# EAGLE design SparkFun_9DoF_ISM330DHCX-MMC5983MA (EAGLE 9.6.2)
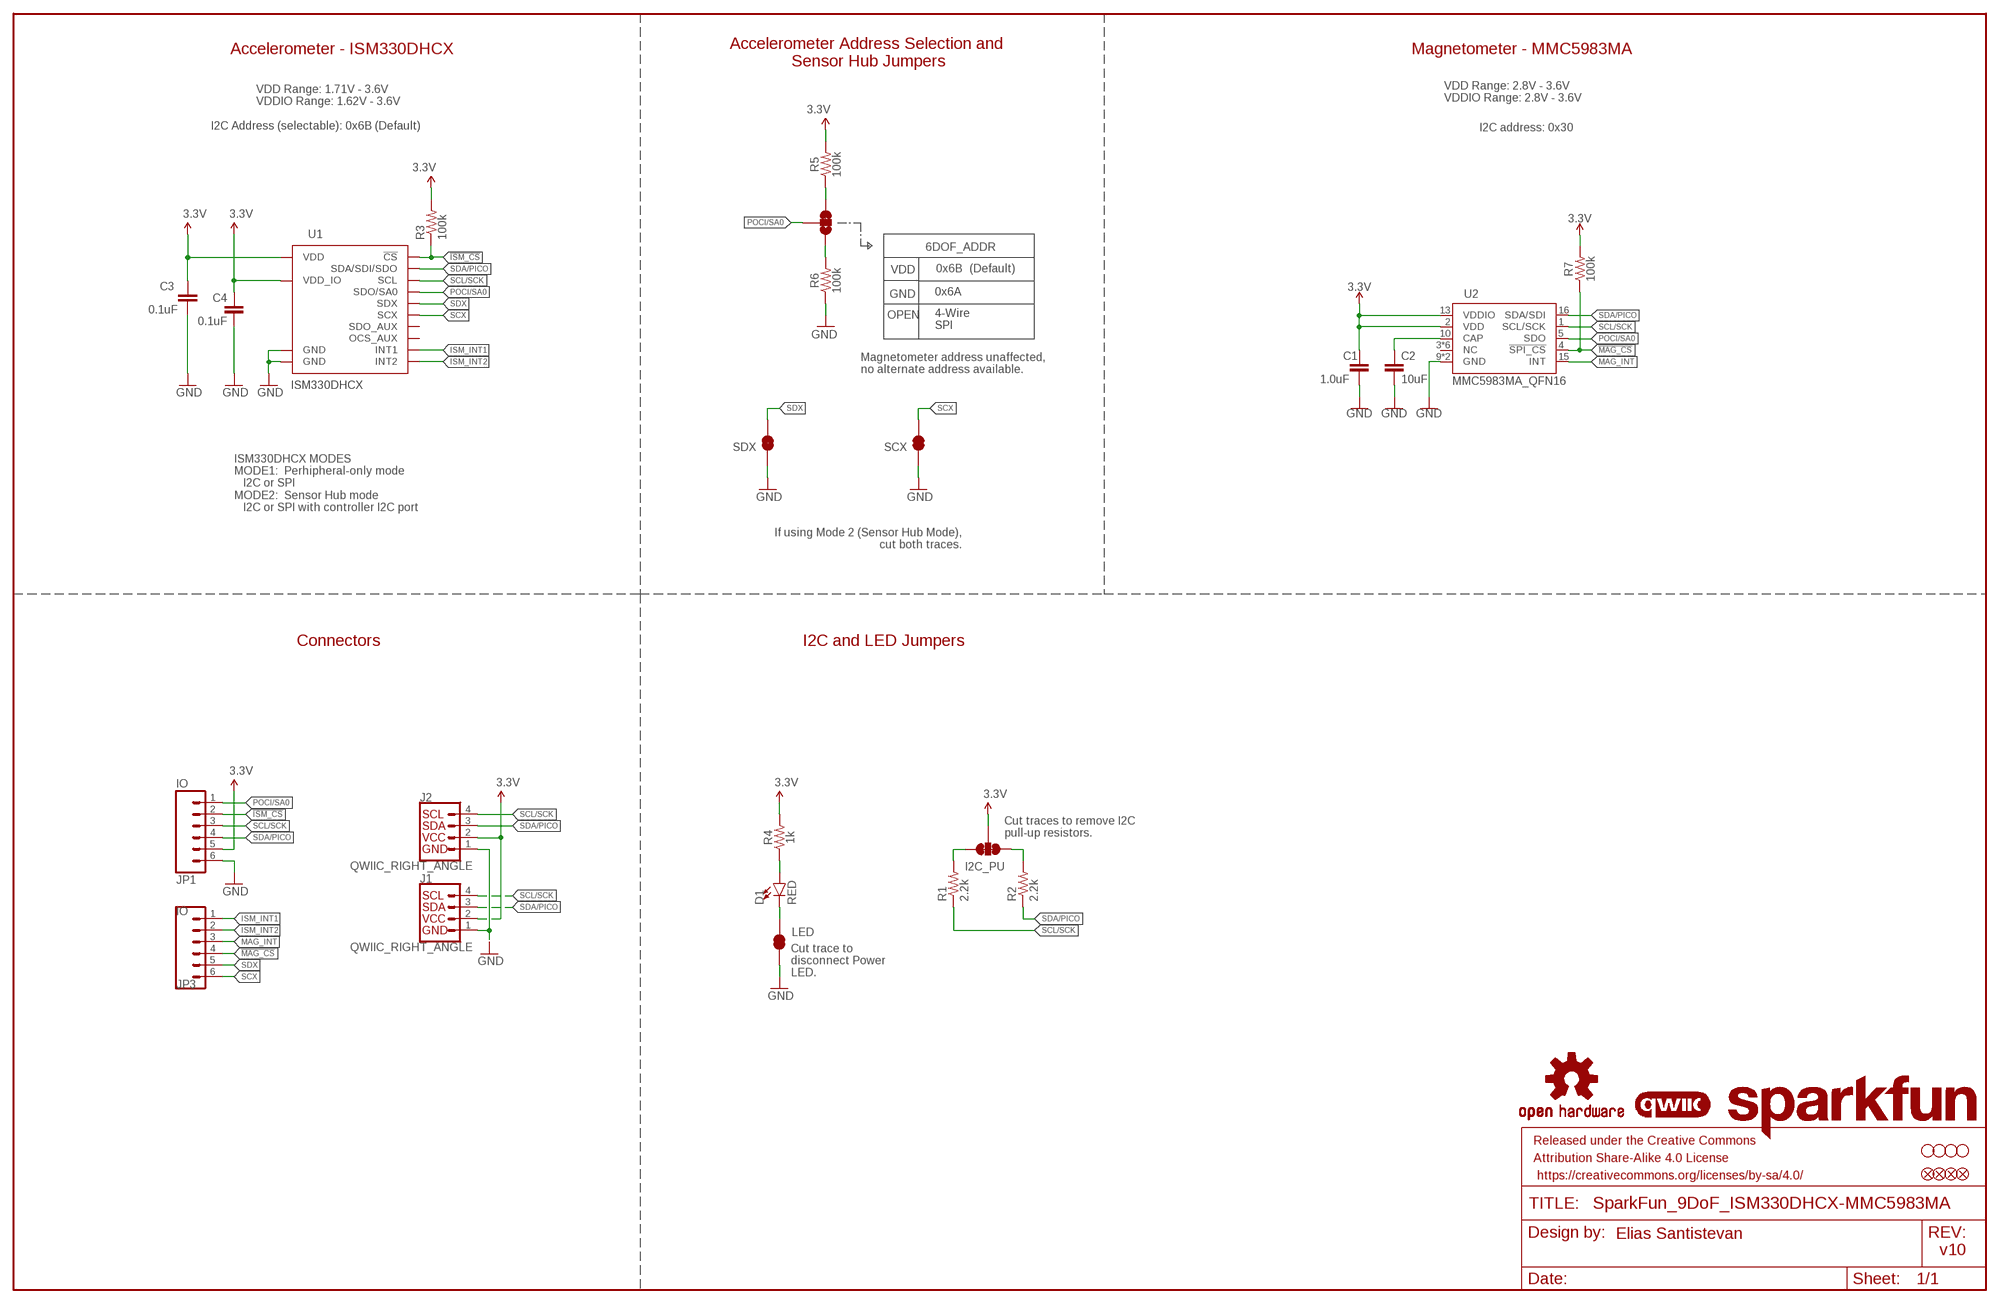
[diagram p0: schematic, sheet 1]

## Parts
6DOF_ADDR  JUMPER-SMT_3_1-NC_TRACE_SILK  [SMT-JUMPER_3_1-NC_TRACE_SILK]
C1  1.0uF  1.0UF-0603-16V-10%  [0603]
C2  10uF  10UF-0603-6.3V-20%  [0603]
C3  0.1uF  0.1UF-0603-25V-(+80/-20%)  [0603]
C4  0.1uF  0.1UF-0603-25V-(+80/-20%)  [0603]
D1  RED  LED-RED0603  [LED-0603]
FD1  FIDUCIALUFIDUCIAL  [FIDUCIAL-MICRO]
FD2  FIDUCIALUFIDUCIAL  [FIDUCIAL-MICRO]
FID1  FIDUCIALUFIDUCIAL  [FIDUCIAL-MICRO]
FID2  FIDUCIALUFIDUCIAL  [FIDUCIAL-MICRO]
FRAME2  FRAME-LEDGER  [CREATIVE_COMMONS]
I2C_PU  S_MODE  JUMPER-SMT_3_2-NC_TRACE_SILK  [SMT-JUMPER_3_2-NC_TRACE_SILK]
J1  QWIIC_RIGHT_ANGLE  QWIIC_CONNECTORJS-1MM  [JST04_1MM_RA]
J2  QWIIC_RIGHT_ANGLE  QWIIC_CONNECTORJS-1MM  [JST04_1MM_RA]
JP1  IO  CONN_06NO_SILK_NO_POP  [1X06_NO_SILK]
JP3  IO  CONN_06NO_SILK_NO_POP  [1X06_NO_SILK]
LED  JUMPER-SMT_2_NC_TRACE_SILK  [SMT-JUMPER_2_NC_TRACE_SILK]
LOGO1  QWIIC_LOGO_4MM  [QWIIC_4MM]
LOGO2  OSHW-LOGOMINI  [OSHW-LOGO-MINI]
LOGO3  SFE_LOGO_NAME.1_INCH  [SFE_LOGO_NAME_.1]
R1  2.2k  2.2KOHM-0603-1/10W-1%  [0603]
R2  2.2k  2.2KOHM-0603-1/10W-1%  [0603]
R3  100k  100KOHM-0603-1/10W-1%  [0603]
R4  1k  1KOHM-0603-1/10W-1%  [0603]
R5  100k  100KOHM-0603-1/10W-1%  [0603]
R6  100k  100KOHM-0603-1/10W-1%  [0603]
R7  100k  100KOHM-0603-1/10W-1%  [0603]
SCX  JUMPER-SMT_2_NC_TRACE_SILK  [SMT-JUMPER_2_NC_TRACE_SILK]
SDX  JUMPER-SMT_2_NC_TRACE_SILK  [SMT-JUMPER_2_NC_TRACE_SILK]
STANDOFF1  STAND-OFFTIGHT  [STAND-OFF-TIGHT]
STANDOFF2  STAND-OFFTIGHT  [STAND-OFF-TIGHT]
STANDOFF3  STAND-OFFTIGHT  [STAND-OFF-TIGHT]
STANDOFF4  STAND-OFFTIGHT  [STAND-OFF-TIGHT]
U1  ISM330DHCX  [LGA-14L]
U2  MMC5983MA_QFN16  [LGA-16-3X3MM-4X4PINS]

## Nets
3.3V: C1.1 C3.1 C4.1 I2C_PU.2 J1.2 J2.2 JP1.5 R3.2 R4.2 R5.2 R7.2 U1.P5(VDD_IO) U1.P8(VDD) U2.2(VDD) U2.13(VDDIO)
!ISM_CS!: JP1.2 R3.1 U1.P12(!CS!)
!MAG_CS!: JP3.4 R7.1 U2.4(!SPI_CS!)
CAP: C2.1 U2.10(CAP)
GND: C1.2 C2.2 C3.2 C4.2 J1.1 J2.1 JP1.6 LED.1 R6.1 SCX.1 SDX.1 U1.P6(GND) U1.P7(GND) U2.9(GND) U2.11(GND)
ISM_INT1: JP3.1 U1.P4(INT1)
ISM_INT2: JP3.2 U1.P9(INT2)
MAG_INT: JP3.3 U2.15(INT)
N$1: 6DOF_ADDR.3 R5.1
N$2: D1.A R4.1
N$3: D1.C LED.2
N$5: I2C_PU.1 R1.2
N$6: I2C_PU.3 R2.2
N$7: 6DOF_ADDR.1 R6.2
POCI/SA0: 6DOF_ADDR.2 JP1.1 U1.P1(SDO/SA0) U2.5(SDO)
SCL/SCK: J1.4 J2.4 JP1.3 R1.1 U1.P13(SCL) U2.1(SCL/SCK)
SCX: JP3.6 SCX.2 U1.P3(SCX)
SDA/PICO: J1.3 J2.3 JP1.4 R2.1 U1.P14(SDA/SDI/SDO) U2.16(SDA/SDI)
SDX: JP3.5 SDX.2 U1.P2(SDX)
Unconnected: U1.P10(OCS_AUX) U1.P11(SDO_AUX) U2.3(NC) U2.6(NC) U2.7(NC) U2.8(NC) U2.12(NC) U2.14(NC)

## Notes on the sheet
- Accelerometer - ISM330DHCX | Magnetometer - MMC5983MA
- Accelerometer Address Selection and 
  Sensor Hub Jumpers
- VDD Range: 2.8V - 3.6V
  VDDIO Range: 2.8V - 3.6V
- VDD Range: 1.71V - 3.6V
  VDDIO Range: 1.62V - 3.6V
- I2C Address (selectable): 0x6B (Default) | I2C address: 0x30
- VDD | 0x6B | (Default)
- GND | 0x6A
- OPEN
- 4-Wire
  SPI
- Magnetometer address unaffected,
  no alternate address available.
- ISM330DHCX MODES
  MODE1:  Perhipheral-only mode
     I2C or SPI
  MODE2:  Sensor Hub mode
     I2C or SPI with controller I2C port
- If using Mode 2 (Sensor Hub Mode), 
  cut both traces.
- Connectors | I2C and LED Jumpers
- Cut traces to remove I2C
  pull-up resistors.
- Cut trace to
  disconnect Power
  LED.
- Elias Santistevan
- v10

## Library data of the parts
6DOF_ADDR = SparkFun-Jumpers:JUMPER-SMT_3_1-NC_TRACE: Normally closed trace jumper (1 of 2 connections) This jumper has a trace between two pads so it's normally closed (NC). The other connection is normally open (NO). Use a razor knife to open the connection. For best results follow the IPC guidelines for cutting traces: Cutout at least 0.063 mm (0.005 in). Remove all loose material to clean up the cut area. Seal the cut with an approved epoxy. Reapply solder to reclose the connection, or to close the NO connection.
C1 = SparkFun-Capacitors:1.0UF: 1µF ceramic capacitors A capacitor is a passive two-terminal electrical component used to store electrical energy temporarily in an electric field.; PROD_ID: CAP-00868
C2 = SparkFun-Capacitors:10UF: 10.0µF ceramic capacitors A capacitor is a passive two-terminal electrical component used to store electrical energy temporarily in an electric field.; PROD_ID: CAP-11015
C3 C4 = SparkFun-Capacitors:0.1UF: 0.1µF ceramic capacitors A capacitor is a passive two-terminal electrical component used to store electrical energy temporarily in an electric field.; PROD_ID: CAP-00810
D1 = SparkFun-LED:LED-RED: Red SMD LED Used in manufacturing of most products at SparkFun Packages: 0603 - SMD 0603 package [Product Link] <http://docs.avagotech.com/docs/AV02-0551EN> 0603 SMART - SMD 0603 SMART package ( more efficient and expensive)[Product Link] <http://www.osram-os.com/Graphics/XPic2/00077099_0.pdf> 1206 - SMD1206 package [Product Link] <https://www.sparkfun.com/datasheets/DevTools/LilyPad/Q150OVS4.pdff> SparkFun Products: Pro Mini 328 -5V <https://www.sparkfun.com/products/821> RedBoard <https://www.sparkfun.com/products/12757> IOIO-OTG <https://www.sparkfun.com/products/13613>; PROD_ID: DIO-00819
FD1 FD2 FID1 FID2 = SparkFun-Aesthetics:FIDUCIAL: Fiducial Alignment Points Point-of-reference for pick-and-place machines and other optical instruments.
FRAME2 = SparkFun-Aesthetics:FRAME-LEDGER: Schematic Frame - Ledger Standard 11x14 US Ledger frame
I2C_PU = SparkFun-Jumpers:JUMPER-SMT_3_2-NC_TRACE: Normally closed trace jumper (2 of 2 connections) This jumper has a trace between all three pads so they are normally closed (NC). Use a razor knife to open the connection(s). For best results follow the IPC guidelines for cutting traces: Cutout at least 0.063 mm (0.005 in). Remove all loose material to clean up the cut area. Seal the cut with an approved epoxy. Reapply solder to reclose the connection(s).
J1 J2 = SparkFun-Connectors:QWIIC_CONNECTOR: SparkFun I2C Standard Qwiic Connector An SMD 1mm pitch JST connector makes it easy and quick (get it? Qwiic?) to connect I2C devices to each other. The Qwiic system <http://www.sparkfun.com/qwiic> enables fast and solderless connection between popular platforms and various sensors and actuators. We carry 200mm <https://www.sparkfun.com/products/14204>, 100mm <https://www.sparkfun.com/products/14205>, 50mm <https://www.sparkfun.com/products/14206>, and breadboard friendly <https://www.sparkfun.com/products/14207> Qwiic cables. We also offer 10 pcs strips <https://www.sparkfun.com/products/14323> the SMD connectors.; PROD_ID: CONN-13694
JP1 JP3 = SparkFun-Connectors:CONN_06: Multi connection point. Often used as Generic Header-pin footprint for 0.1 inch spaced/style header connections On any of the 0.1 inch spaced packages, you can populate with these: Break Away Headers - Straight <https://www.sparkfun.com/products/116> (PRT-00116) Break Away Male Headers - Right Angle <https://www.sparkfun.com/products/553> (PRT-00553) Female Headers <https://www.sparkfun.com/products/115> (PRT-00115) Break Away Headers - Machine Pin <https://www.sparkfun.com/products/117> (PRT-00117) Break Away Female Headers - Swiss Machine Pin <https://www.sparkfun.com/products/743> (PRT-00743) Arduino Stackable Header - 6 Pin <https://www.sparkfun.com/products/9280> (PRT-09280) For SCREWTERMINALS and SPRING TERMINALS visit here: Screw Terimnals on SparkFun.com <https://www.sparkfun.com/search/results?term=Screw+Terminals> (5mm/3.5mm/2.54mm spacing) This device is also useful as a general connection point to wire up your design to another part of your project. Our various solder wires solder well into these plated through hole pads. Hook-Up Wire - Assortment (Stranded, 22 AWG) <https://www.sparkfun.com/products/11375> (PRT-11375) Hook-Up Wire - Assortment (Solid Core, 22 AWG) <https://www.sparkfun.com/products/11367> (PRT-11367) View the entire wire category on our website here <https://www.sparkfun.com/categories/141>
LED SCX SDX = SparkFun-Jumpers:JUMPER-SMT_2_NC_TRACE: Normally closed trace jumper This jumper has a trace between two pads so it's normally closed (NC). Use a razor knife to open the connection. For best results follow the IPC guidelines for cutting traces: Cutout at least 0.063 mm (0.005 in). Remove all loose material to clean up the cut area. Seal the cut with an approved epoxy. Reapply solder to reclose the connection.
LOGO1 = SparkFun-Aesthetics:QWIIC_LOGO: Qwiic Logos for placement on schematic and PCB. The 5.5mm silk logo is best for placing next to Qwiic connector.
LOGO2 = SparkFun-Aesthetics:OSHW-LOGO: Open-Source Hardware (OSHW) Logo This logo indicates the piece of hardware it is found on incorporates a OSHW license and/or adheres to the definition of open source hardware found here: http://freedomdefined.org/OSHW
LOGO3 = SparkFun-Aesthetics:SFE_LOGO_NAME: SparkFun Font Logo This is the SparkFun name logo. The logo on the schematic will always be the same size; the package variant is the height of the flame part of the logo (or the height the flame would be, if it were drawn). Default layer for the logo on the board is tSilk.
R1 R2 = SparkFun-Resistors:2.2KOHM: 2.2kΩ resistor A resistor is a passive two-terminal electrical component that implements electrical resistance as a circuit element. Resistors act to reduce current flow, and, at the same time, act to lower voltage levels within circuits. - Wikipedia; PROD_ID: RES-08272
R3 R5-R7 = SparkFun-Resistors:100KOHM: 100kΩ resistor A resistor is a passive two-terminal electrical component that implements electrical resistance as a circuit element. Resistors act to reduce current flow, and, at the same time, act to lower voltage levels within circuits. - Wikipedia; PROD_ID: RES-07828
R4 = SparkFun-Resistors:1KOHM: 1kΩ resistor A resistor is a passive two-terminal electrical component that implements electrical resistance as a circuit element. Resistors act to reduce current flow, and, at the same time, act to lower voltage levels within circuits. - Wikipedia; PROD_ID: RES-07856
STANDOFF1-STANDOFF4 = SparkFun-Hardware:STAND-OFF: Stand Off Drill holes for mechanically mounting via screws, standoffs, etc. Note: Use the keepout ring to avoid running the screw head into surrounding components. Variant Overviews STAND-OFF - Mechanical footprint for a #4 phillips button head screw. STAND-OFF-TIGHT - Mechanical footprint for a #4 phillips button head screw, Example SparkFun Products Screw - Phillips Head (1/4", 4-40, 10 pack) <https://www.sparkfun.com/products/10453> (PRT-10453) Screw - Phillips Head (1/2", 4-40, 10 pack) <https://www.sparkfun.com/products/10452> (PRT-10452) Screw - Phillips Head (3/4", 4-40, 10 pack) <https://www.sparkfun.com/products/10451> (PRT-10451) Screw - Phillips Head (1", 4-40, 10 pack) <https://www.sparkfun.com/products/10450> (PRT-10450)
U1 = ISM330DHCX:ISM330DHCX: ISM330DHCX 6DoF The ISM330DHCX is a system-in-package featuring a high-performance 3D digital accelerometer and 3D digital gyroscope tailored for Industry 4.0 applications.; PROD_ID: IC-16693
U2 = SparkFun-Sensors:MMC5983MA: High Performance 3-axis Magnetic Sensor The MMC5983MA is an AEC-Q100 qualified complete 3-axis magnetic sensor with on-chip signal processing and integrated I2C/SPI bus suitable for use in automotive applications. The device can be connected directly to a microprocessor, eliminating the need for A/D converters or timing resources. It can measure magnetic fields within the full scale range of ±8 Gauss (G), with 0.25mG/0.0625mG per LSB resolution at 16bits/18bits operation mode and 0.4 mG total RMS noise level, enabling heading accuracy of ±0.5° in electronic compass applications.; PROD_ID: IC-16314

## Board
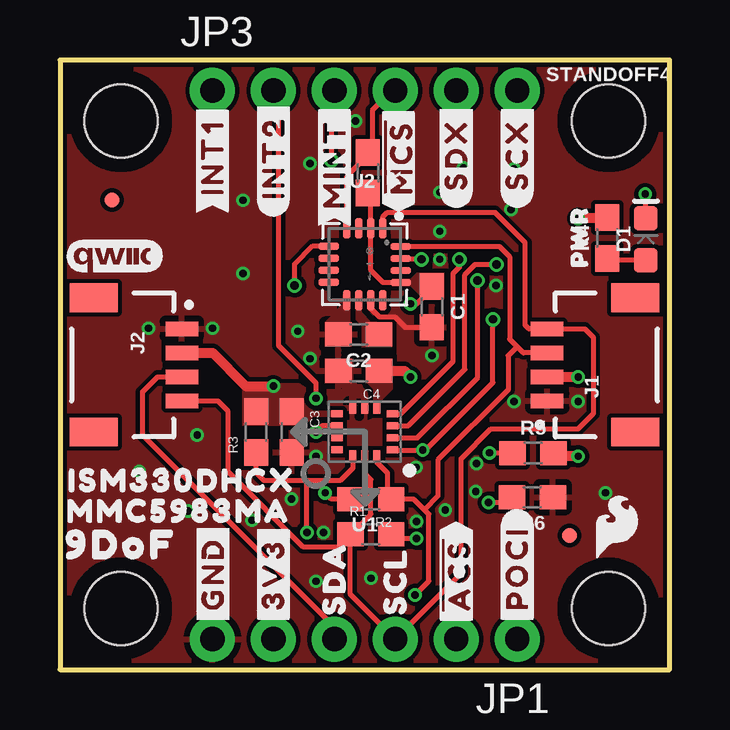
[diagram p1: board, top side]
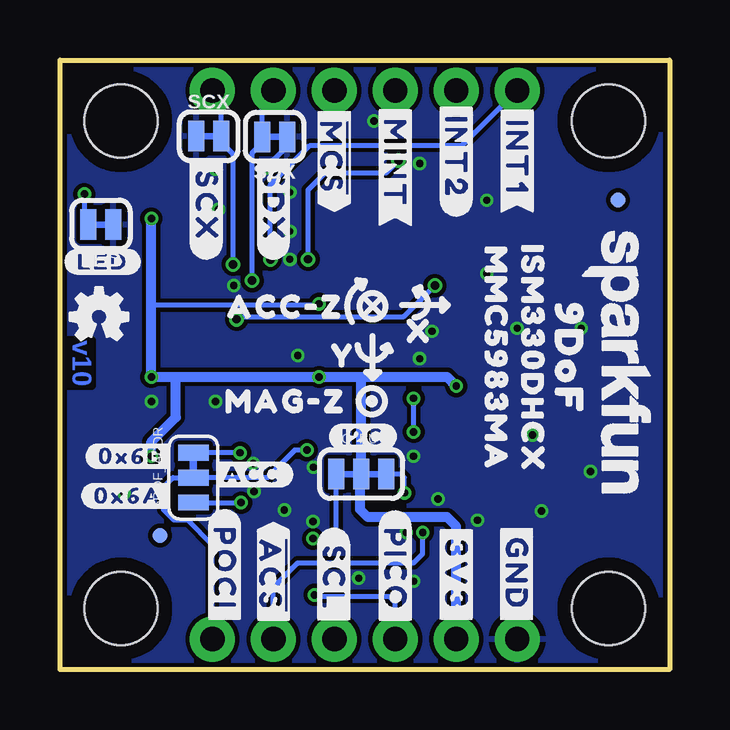
[diagram p2: board, bottom side, seen from below]

Size 25.4 x 25.4 mm. Coordinates in mm from the lower left corner, seen from the top.
Outline: 25.4,25.4 0,25.4 0,0 25.4,0 25.4,25.4
Copper layers (1*16): Top 0.035mm / dielectric 1.5mm / Bottom 0.035mm
Design rules "SparkFun-2-Layer-Minimum-JLCPCB": minimum track width 5mil, minimum drill 0.3mm, track to track 5mil, track to pad 5mil, pad to pad 5mil, via to via 5mil, smd to smd 5mil, copper to edge 7mil, drill to drill 7mil, minimum pad ring 5mil, minimum via ring 5mil, stop-mask expansion 2.5mil, vias tented up to drill 25mil, thermal gap 10mil
tRestrict: area 12.4,10.5 to 12.5,10.8; area 12.8,16 to 13.1,16.1; area 11.8,16 to 12.1,16.1; area 11.8,16 to 12.1,16.1; area 11.3,15.6 to 11.6,15.6

### Footprints (pad centres in the part's own frame; a part is rotated, then mirrored left to right if it is on the bottom)
SMT-JUMPER_3_1-NC_TRACE_SILK = smd 0.66 x 1.27: 1 -1.041,0; 2 0,0; 3 1.041,0
0603 = smd 1.1 x 1: 1 -0.85,0; 2 0.85,0
LED-0603 = smd 1 x 1: A -0.877,0; C 0.877,0
FIDUCIAL-MICRO = smd 0.635 x 0.635: 1 0,0
SMT-JUMPER_3_2-NC_TRACE_SILK = smd 0.66 x 1.27: 1 -1.041,0; 2 0,0; 3 1.041,0
JST04_1MM_RA = smd 0.6 x 1.35: 1 -1.5,0; 2 -0.5,0; 3 0.5,0; 4 1.5,0 | smd 1.2 x 2: NC1 2.8,-3.675; NC2 -2.8,-3.675
1X06_NO_SILK = drill 1.016 pad 1.88: 1 0,0; 2 2.54,0; 3 5.08,0; 4 7.62,0; 5 10.16,0; 6 12.7,0
SMT-JUMPER_2_NC_TRACE_SILK = smd 0.66 x 1.27: 1 -0.521,0; 2 0.521,0
STAND-OFF-TIGHT = hole 3.048: 0,0
LGA-14L = smd 0.48 x 0.3: P1 -1.163,0.75; P2 -1.163,0.25; P3 -1.163,-0.25; P4 -1.163,-0.75; P8 1.163,-0.75; P9 1.163,-0.25; P10 1.163,0.25; P11 1.163,0.75 | smd 0.3 x 0.48: P5 -0.5,-1; P6 0,-1; P7 0.5,-1; P12 0.5,1; P13 0,1; P14 -0.5,1
LGA-16-3X3MM-4X4PINS = smd 0.3 x 0.85: 1 0.754,1.498; 2 0.254,1.498; 3 -0.246,1.498; 4 -0.746,1.498; 9 -0.746,-1.506; 10 -0.246,-1.506; 11 0.254,-1.506; 12 0.754,-1.506 | smd 0.85 x 0.3: 5 -1.508,0.746; 6 -1.508,0.246; 7 -1.508,-0.254; 8 -1.508,-0.754; 13 1.496,-0.764; 14 1.496,-0.264; 15 1.496,0.236; 16 1.496,0.736

### Placement (x,y rotation side)
6DOF_ADDR  19.84,8 90 bottom
C1  15.49,15.11 270 top
C2  12.45,13.97 180 top
C3  9.65,9.9 270 top
C4  12.45,12.45 180 top
D1  24.41,17.93 90 top
FD1  2.16,19.56 0 bottom
FD2  21.23,5.59 0 bottom
FID1  2.16,19.56 0 top
FID2  21.23,5.59 0 top
FRAME2  -19.05,-20.32 0 top  (outside the outline)
I2C_PU  12.85,8.15 0 bottom
J1  20.29,12.7 90 top
J2  5.08,12.7 270 top
JP1  19.05,1.27 180 top
JP3  6.35,24.13 0 top
LED  23.7,18.54 180 bottom
LOGO1  2.29,17.22 0 top
LOGO2  23.77,14.71 0 bottom
LOGO3  2.21,12.79 270 bottom
R1  12.95,5.63 0 top
R2  12.95,7.11 180 top
R3  8.18,9.9 90 top
R4  22.81,17.98 90 top
R5  19.71,9.02 0 top
R6  19.68,7.19 180 top
R7  12.83,20.7 270 top
SCX  19.2,22.23 0 bottom
SDX  16.46,22.2 180 bottom
STANDOFF1  2.54,22.86 0 top
STANDOFF2  2.54,2.54 0 top
STANDOFF3  22.86,2.54 0 top
STANDOFF4  22.86,22.86 0 top
U1  12.7,9.91 180 top
U2  12.7,16.89 0 top
U$1  [#3V3#1]  8.89,3.96 90 top
U$2  [#GND#0]  6.38,3.99 90 top
U$3  [ISM330DHCX331]  5.08,7.87 0 top
U$4  [SDA14]  11.43,3.81 90 top
U$5  [SCL13]  13.97,3.68 90 top
U$6  [#POCI#11]  18.54,4.22 270 bottom
U$7  [ISM330DHCX331]  5.71,12.95 270 bottom
U$8  [#INT1#0]  6.35,21.34 90 top
U$9  [#INT2#3]  8.89,21.34 90 top
U$10  [#INT1#2]  6.35,21.34 270 bottom
U$11  [#INT2#2]  8.89,21.34 270 bottom
U$12  [#MINT#4]  11.43,21.08 270 bottom
U$13  [ACC#Z5985]  16,15.11 0 bottom
U$14  [MAG#Z5984]  16,11.18 0 bottom
U$15  [#3V3#1]  8.89,3.96 270 bottom
U$16  [#LED#11]  23.62,16.99 0 bottom
U$17  [#GND#0]  6.38,3.99 270 bottom
U$18  [#POCI#12]  19.05,4.22 90 top
U$19  [##MCS##5]  13.97,21.34 270 bottom
U$20  [#SDX#7]  16.51,19.3 270 bottom
U$21  [MMC5983MA24]  4.95,6.6 0 top
U$22  [#SCL#5]  14,3.81 270 bottom
U$23  [#SCX#8]  19.3,19.3 270 bottom
U$24  [9DOF24]  2.54,5.21 0 top
U$25  [#I2C#11]  12.78,9.7 0 bottom
U$26  [#PICO#13]  11.43,4.17 270 bottom
U$27  [##ACS##6]  16.51,3.94 270 bottom
U$28  [PWR8]  21.64,18.03 90 top
U$29  [SFE_LOGO_FLAME_.1]  23.19,5.97 0 top
U$30  [9DOF24]  4.19,12.95 270 bottom
U$31  [#MINT#5]  11.43,21.08 90 top
U$32  [MMC5983MA24]  7.24,12.95 270 bottom
U$33  [#0X6A#15]  22.56,7.24 0 bottom
U$34  [##MCS##7]  14.1,21.34 90 top
U$35  [#SDX#9]  16.51,21.46 90 top
U$36  [#SCX#11]  19.05,21.46 90 top
U$37  [X2114]  10.41,14.1 0 bottom
U$38  [Y2115]  13.59,13.08 0 bottom
U$39  [##ACS##8]  16.51,3.94 90 top
U$40  [#0X6B#15]  22.45,8.89 0 bottom
U$41  [#ACC#17]  17.4,8.13 0 bottom

### Tracks (layer width: path | path; a pad name or v marks a point on that pad's centre or on a via)
3.3V  (via drill 0.3)
  Top 0.203: v14.61,15.24 14.86,15.24 15.49,15.88 C1.1 | U2.13 13.46,16.13 12.95,16.64 U2.2 12.95,19.53 12.83,19.66 R7.2
  Top 0.406: J1.2 v21.58,12.2 v21.59,12.19 | v21.59,18.8 21.63,18.83 R4.2 | R5.2 20.69,8.89 v21.59,8.89 | J2.2 6.36,13.2 7.75,11.81 v8.89,11.81 | C4.1 14.35,12.45 v14.61,12.19
  Bottom 0.203: 21.59,15.19 14.66,15.19 v14.61,15.24
  Bottom 0.406: v21.59,8.89 21.59,9.49 20.57,10.51 20.57,12.06 20.7,12.19 | 12.83,12.19 v14.61,12.19 20.7,12.19 | 12.83,12.19 9.27,12.19 v8.89,11.81 | 20.7,12.19 v21.59,12.19 21.59,15.19 v21.59,18.8 | JP1.5 8.89,5.97 9.27,6.35 12.57,6.35 12.89,6.67 12.89,8.11 I2C_PU.2 12.85,12.17 12.83,12.19
  pour Top (isolate 0.203, no thermals): 11.68,10.54 10.54,10.54 10.16,10.16 7.62,10.16 7.62,11.94 9.96,11.94 10.21,11.77 10.21,11.13 10.54,10.79 11.68,10.79
  pour Top (no thermals): 13.84,16 14.61,16 14.99,15.62 14.99,15.49 16,15.49 16,16.51 14.99,16.51 14.86,16.51 14.61,16.26 13.84,16.26
  pour Top (no thermals): 13.08,10.79 13.08,11.68 12.83,11.94 12.83,12.95 13.84,12.95 13.84,11.94 13.84,11.68 13.34,11.18 13.34,10.67 13.08,10.67
!ISM_CS!  (via drill 0.3)
  Top 0.203: U1.P12 12.2,8.4 11.68,7.87 10.29,7.87 | 10.29,7.87 8.51,7.87 8.18,8.2 R3.1 | v10.29,5.71 10.29,7.87
  Bottom 0.203: JP1.2 16.51,3.43 15.49,4.45 10.67,4.45 10.29,4.83 v10.29,5.71
!MAG_CS!
  Top 0.203: JP3.4 13.84,24.13 13.02,23.3 13.02,21.74 R7.1 12.83,21.42 11.95,20.55 U2.4
CAP
  pour Top (no thermals): 12.32,15.75 12.32,14.61 12.57,14.35 12.57,13.46 13.84,13.46 13.84,14.48 12.95,14.48 12.57,14.86 12.57,15.75
GND  (via drill 0.3)
  Top 0.203: U2.11 12.95,15.06 13.31,14.7 13.94,14.7 14.38,14.26 C1.2
  Bottom 0.203: v16.82,20.9 16.82,20.93 15.94,21.81 SDX.1
  other vias: 7.62,16.51 15.49,13.08 18.92,11.18 21.59,11.18 3.68,14.22 6.35,14.22 22.73,7.37 9.91,14.1 10.41,12.95 10.67,8.89 7.62,19.56 10.41,21.08 18.92,20.85 18.8,19.18 12.95,3.81 10.67,3.68 9.65,7.11 17.32,7.42 8,6.22 5.33,6.6 5.71,9.78 3.3,8.26 18.16,16 15.82,17.09 17.35,8.59 14.83,8.43 10.97,5.71 14.86,6.17 15.82,19.89 15.82,18.26 16.05,6.65 12.32,22.86
  pour Bottom (isolate 0.178): 25.4,0 25.4,25.4 0,25.4 0,0
  pour Top (isolate 0.178, rank 2): 25.4,0 25.4,25.4 0,25.4 0,0
  pour Top (no thermals): 12.06,10.67 12.06,11.43 11.56,11.94 11.05,11.94 11.05,12.95 12.19,12.95 12.19,12.06 12.83,11.43 12.83,10.67 12.57,10.67 12.57,11.3 12.32,11.3 12.32,10.67
  pour Top (no thermals): 12.06,15.62 12.06,13.46 11.05,13.46 11.05,14.48 11.81,15.24 11.81,15.62
ISM_INT1  (via drill 0.35)
  Top 0.203: U1.P4 14.19,10.66 16.38,12.85 16.38,16.51 16.64,16.76 v16.64,17.09
  Bottom 0.203: v16.64,17.09 16.64,20.19 14.99,21.84 8.64,21.84 JP3.1
ISM_INT2  (via drill 0.3)
  Top 0.203: U1.P9 10.92,10.16 v10.67,9.91 | v10.67,11.3 10.67,11.94 9.12,13.48 9.12,23.9 JP3.2
  Bottom 0.203: v10.67,9.91 v10.67,11.3
MAG_INT  (via drill 0.35)
  Top 0.203: U2.15 15.03,17.13 v15.06,17.1 | JP3.3 11.3,24 v11.3,21.21
  Bottom 0.203: v15.06,17.1 15.06,19.99 14.35,20.7 11.81,20.7 v11.3,21.21
N$1  (via drill 0.3)
  Top 0.203: R5.1 17.91,9.02 v17.9,9.03
  Bottom 0.203: v17.9,9.03 17.91,9.04 6DOF_ADDR.3
N$2
  Top 0.203: D1.A 22.89,17.05 R4.1
N$3  (via drill 0.3)
  Top 0.203: D1.C 24.41,19.79 v24.38,19.81
  Bottom 0.203: v24.38,19.81 24.38,18.71 LED.2
N$5  (via drill 0.3)
  Top 0.203: v14.86,5.46 13.97,5.46 R1.2
  Bottom 0.203: v14.86,5.46 14.1,5.46 13.89,5.66 I2C_PU.1
N$6  (via drill 0.3)
  Top 0.203: R2.2 11.31,7.11 v11.05,7.37
  Bottom 0.203: v11.05,7.37 11.05,8 11.2,8.15 I2C_PU.3
N$7  (via drill 0.3)
  Top 0.203: R6.2 18.61,6.96 v17.86,6.96
  Bottom 0.203: 6DOF_ADDR.1 v17.86,6.96
POCI/SA0  (via drill 0.3, 0.35)
  Top 0.203: U1.P1 13.87,9.14 v15.11,9.14 15.22,9.14 18.03,11.95 v18.03,14.61 v18.04,14.6 | v9.78,16 9.78,16.89 10.54,17.65 11.18,17.65 U2.5
  Bottom 0.203: JP1.1 19.05,5.21 20.07,6.22 20.65,6.22 21.08,6.66 21.08,7.62 20.7,8 6DOF_ADDR.2 16.76,8 15.62,9.14 v15.11,9.14 | v18.04,14.6 17.93,14.71 11.07,14.71 v9.78,16
SCL/SCK
  Top 0.203: U2.1 13.45,18.86 13.64,19.05 18.12,19.05 19.38,17.79 19.38,14.35 19.53,14.2 J1.4 21.87,14.2 22.23,13.84 22.23,10.67 21.59,10.03 17.96,10.03 16.71,8.79 16.71,4.01 JP1.3 12.1,3.14 R1.1 | R1.1 11.6,5.12 10.12,5.12 6.99,8.26 6.99,10.79 6.58,11.2 J2.4 | R1.1 12.95,6.48 12.95,7.92 12.7,8.17 U1.P13
SCX  (via drill 0.35)
  Top 0.203: U1.P3 14.51,10.16 16.87,12.51 16.87,16.45 17.3,16.88 v18.18,16.88
  Bottom 0.203: v18.18,16.88 18.18,21.47 18.68,21.97 SCX.2 18.68,23.76 JP3.6
SDA/PICO  (via drill 0.3)
  Top 0.203: U1.P14 13.2,8.64 13.65,8.19 13.65,7.26 R2.1 14.74,7.11 15.18,6.67 | JP1.4 11.43,1.78 3.43,9.78 3.43,11.56 4.06,12.19 J2.3 | U2.16 18.31,17.63 18.73,17.21 18.73,13.77 19.05,13.46 | J1.3 19.3,13.2 19.05,13.46 | 19.05,13.46 18.67,13.08 18.67,11.66 15.75,8.74 15.75,7.24 15.18,6.67 | v14.8,3.11 15.37,3.68 15.37,6.48 15.18,6.67
  Bottom 0.203: v14.8,3.11 14.73,3.05 11.68,3.05 11.43,2.79 JP1.4
SDX  (via drill 0.35)
  Top 0.203: U1.P2 14.89,9.66 17.4,12.17 v17.4,16.2
  Bottom 0.203: v17.4,16.2 17.4,21.53 16.98,21.95 SDX.2 16.98,23.66 JP3.5

### Text on the board
Bottom: v10
tDocu: Elias Santistevan